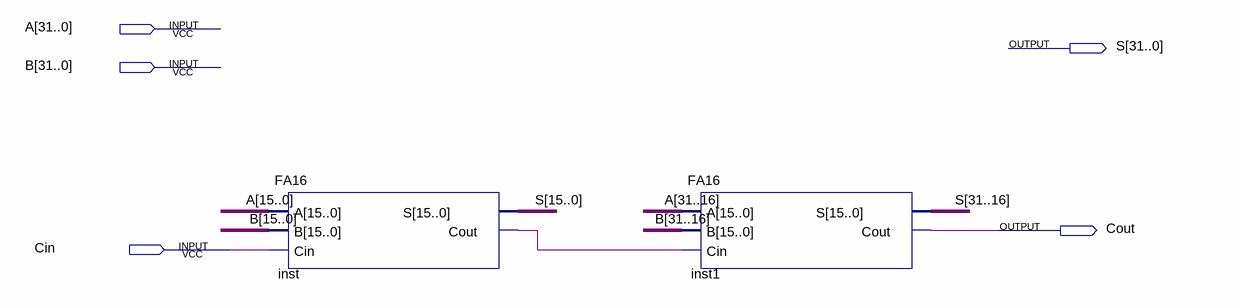
[diagram p0: schematic sheet]
// Quartus schematic FA32.bdf as structural Verilog: 2 symbols, 5 pins
module FA32 (
  input  [31:0] A,
  input  [31:0] B,
  input  Cin,
  output [31:0] S,
  output Cout
);

  wire inst_cout;

  FA16 inst (.A(A[15:0]), .B(B[15:0]), .Cin(Cin), .S(S[15:0]), .Cout(inst_cout));
  FA16 inst1 (.A(A[31:16]), .B(B[31:16]), .Cin(inst_cout), .S(S[31:16]), .Cout(Cout));
endmodule
